# Altium schematic sheet MCU.SchDoc
size A4; SheetNumber: 4; SheetTotal: 5
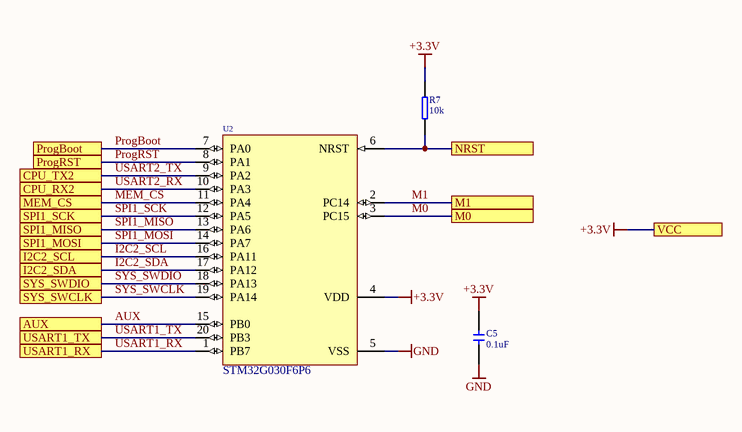
[diagram p0: MCU.SchDoc]

## Parts
C5  value 0.1uF  [CERCAP 0402]
R7  value 10k  [RES 0402]
U2  STM32G030F6P6  [TSSOP-20]

## Ports
AUX, CPU_RX2, CPU_TX2, I2C2_SCL, I2C2_SDA, M0, M1, MEM_CS, NRST, ProgBoot, ProgRST, SPI1_MISO, SPI1_MOSI, SPI1_SCK, SYS_SWCLK, SYS_SWDIO, USART1_RX, USART1_TX, VCC

## Nets
+3.3V: C5.2 R7.2 U2.4(VDD) ; port VCC
GND: C5.1 U2.5(VSS)
AUX: U2.15(PB0) ; port AUX
I2C2_SCL: U2.16(PA11) ; port I2C2_SCL
I2C2_SDA: U2.17(PA12) ; port I2C2_SDA
M0: U2.3(PC15) ; port M0
M1: U2.2(PC14) ; port M1
MEM_CS: U2.11(PA4) ; port MEM_CS
NRST: R7.1 U2.6(NRST) ; port NRST
ProgBoot: U2.7(PA0) ; port ProgBoot
ProgRST: U2.8(PA1) ; port ProgRST
SPI1_MISO: U2.13(PA6) ; port SPI1_MISO
SPI1_MOSI: U2.14(PA7) ; port SPI1_MOSI
SPI1_SCK: U2.12(PA5) ; port SPI1_SCK
SYS_SWCLK: U2.19(PA14) ; port SYS_SWCLK
SYS_SWDIO: U2.18(PA13) ; port SYS_SWDIO
USART1_RX: U2.1(PB7) ; port USART1_RX
USART1_TX: U2.20(PB3) ; port USART1_TX
USART2_RX: U2.10(PA3) ; port CPU_RX2
USART2_TX: U2.9(PA2) ; port CPU_TX2

## Library data of the parts
C5 = !Capacitor: Capacitor; IsSMT: NoSMT; Diel: X7R; Voltage: *
R7 = !Resistor: Resistor; IsSMT: NoSMT
U2 = STM32G030F6P6: Cortex-M0+